# Altium project PCB_Project.PrjPcb
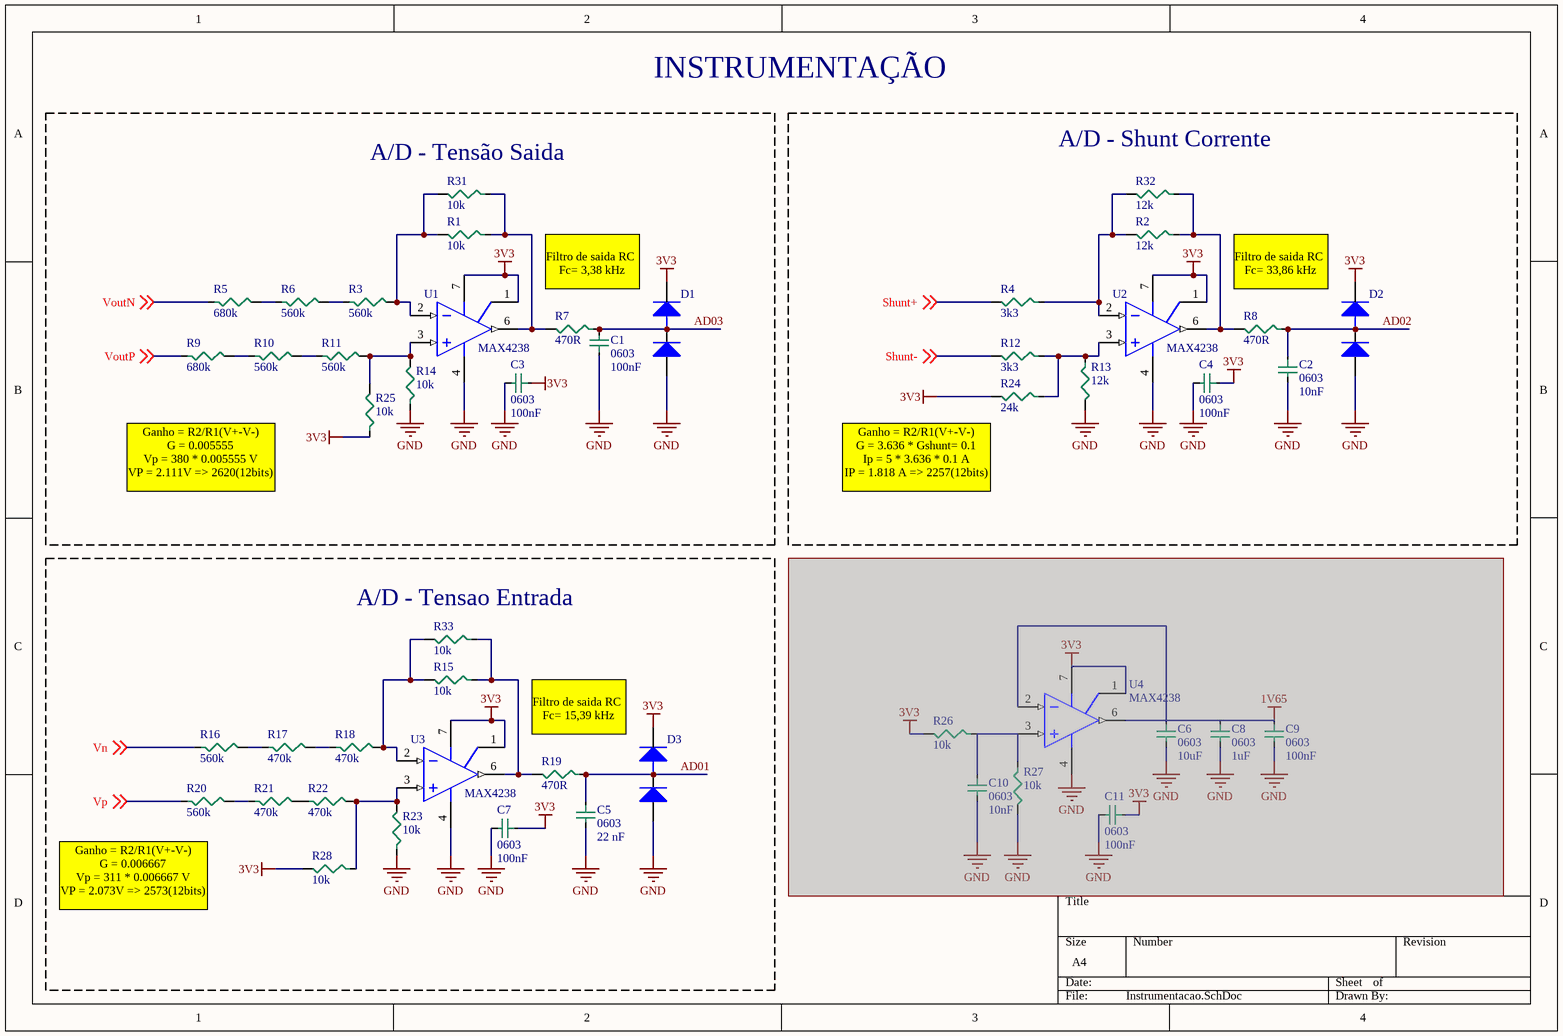
[diagram p0: Instrumentacao.SchDoc]
2 sheets, 95 parts. Net scope: global (net labels, ports and power ports of the same name join across sheets).
Board file: PCBv2.PcbDoc
Sheets:
  Instrumentacao.SchDoc
  GateDrive.SchDoc

## Sheet Instrumentacao.SchDoc
size A4

### Parts
(Parts that share a designator on the sheet are numbered #1, #2 ... from top to bottom, then left to right.)
C1  0603  value 100nF  [0603C]
C2  0603  value 10nF  [0603C]
C3  0603  value 100nF  [0603C]
C4  0603  value 100nF  [0603C]
C5  0603  value 22 nF  [0603C]
C6  0603  value 10uF  [0603C]  (masked out: inside a compile mask, not in the netlist)
C7  0603  value 100nF  [0603C]
C8#1  0603  value 1uF  [0603C]  (masked out: inside a compile mask, not in the netlist)
C9#1  0603  value 100nF  [0603C]  (masked out: inside a compile mask, not in the netlist)
C10#1  0603  value 10nF  [0603C]  (masked out: inside a compile mask, not in the netlist)
C11#1  0603  value 100nF  [0603C]  (masked out: inside a compile mask, not in the netlist)
D1  BAT54S  [SOT23]  (value not drawn)
D2  BAT54S  [SOT23]  (value not drawn)
D3  BAT54S  [SOT23]  (value not drawn)
R1  value 10k  [0603]  (hidden comment: 0603)
R2  value 12k  [0603]  (hidden comment: 0603)
R3  value 560k  [0603]  (hidden comment: 0603)
R4  value 3k3  [0603]  (hidden comment: 0603)
R5  value 680k  [0603]  (hidden comment: 0603)
R6  value 560k  [0603]  (hidden comment: 0603)
R7  value 470R  [0603]  (hidden comment: 0603)
R8  value 470R  [0603]  (hidden comment: 0603)
R9  value 680k  [0603]  (hidden comment: 0603)
R10  value 560k  [0603]  (hidden comment: 0603)
R11  value 560k  [0603]  (hidden comment: 0603)
R12  value 3k3  [0603]  (hidden comment: 0603)
R13  value 12k  [0603]  (hidden comment: 0603)
R14  value 10k  [0603]  (hidden comment: 0603)
R15  value 10k  [0603]  (hidden comment: 0603)
R16  value 560k  [0603]  (hidden comment: 0603)
R17  value 470k  [0603]  (hidden comment: 0603)
R18  value 470k  [0603]  (hidden comment: 0603)
R19  value 470R  [0603]  (hidden comment: 0603)
R20  value 560k  [0603]  (hidden comment: 0603)
R21  value 470k  [0603]  (hidden comment: 0603)
R22  value 470k  [0603]  (hidden comment: 0603)
R23  value 10k  [0603]  (hidden comment: 0603)
R24#1  value 24k  [0603]  (hidden comment: 0603)
R25#1  value 10k  [0603]  (hidden comment: 0603)
R26#1  value 10k  [0603]  (hidden comment: 0603)  (masked out: inside a compile mask, not in the netlist)
R27#1  value 10k  [0603]  (hidden comment: 0603)  (masked out: inside a compile mask, not in the netlist)
R28#1  value 10k  [0603]  (hidden comment: 0603)
R31#1  value 10k  [0603]  (hidden comment: 0603)
R32#1  value 12k  [0603]  (hidden comment: 0603)
R33#1  value 10k  [0603]  (hidden comment: 0603)
U1  MAX4238  [SOIC8]
U2  MAX4238  [SOIC8]
U3  MAX4238  [SOIC8]
U4#1  MAX4238  [SOIC8]  (masked out: inside a compile mask, not in the netlist)

### Blocks framed on the sheet
A/D - Tensão Saida: C1 C3 D1 R1 R3 R5-R7 R9-R11 R14 R25#1 R31#1 U1
A/D - Shunt Corrente: C2 C4 D2 R2 R4 R8 R12 R13 R24#1 R32#1 U2
A/D - Tensao Entrada: C5 C7 D3 R15-R23 R28#1 R33#1 U3

### Nets
3V3: C3.1 C4.1 C7.1 D1.2(K) D2.2(K) D3.2(K) R24#1.2 R25#1.1 R28#1.2 U1.1(BAL) U1.7(V+) U2.1(BAL) U2.7(V+) U3.1(BAL) U3.7(V+)
GND: C1.1 C2.2 C3.2 C4.2 C5.2 C7.2 D1.1(A) D2.1(A) D3.1(A) R13.2 R14.1 R23.1 U1.4(V-) U2.4(V-) U3.4(V-)
AD01: C5.1 D3.3(M) R19.1
AD02: C2.1 D2.3(M) R8.1
AD03: C1.2 D1.3(M) R7.1
Shunt+: R4.2 ; off-sheet Shunt+
Shunt-: R12.2 ; off-sheet Shunt-
Vn: R16.1 ; off-sheet Vn
VoutN: R5.1 ; off-sheet VoutN
VoutP: R9.1 ; off-sheet VoutP
Vp: R20.1 ; off-sheet Vp
NetR1_1: R1.1 R7.2 R31#1.1 U1.6(OUT)
NetR1_2: R1.2 R3.2 R31#1.2 U1.2(IN-)
NetR2_1: R2.1 R8.2 R32#1.1 U2.6(OUT)
NetR2_2: R2.2 R4.1 R32#1.2 U2.2(IN-)
NetR3_1: R3.1 R6.2
NetR5_2: R5.2 R6.1
NetR9_2: R9.2 R10.1
NetR10_2: R10.2 R11.1
NetR11_2: R11.2 R14.2 R25#1.2 U1.3(IN+)
NetR12_1: R12.1 R13.1 R24#1.1 U2.3(IN+)
NetR15_1: R15.1 R19.2 R33#1.1 U3.6(OUT)
NetR15_2: R15.2 R18.2 R33#1.2 U3.2(IN-)
NetR16_2: R16.2 R17.1
NetR17_2: R17.2 R18.1
NetR20_2: R20.2 R21.1
NetR21_2: R21.2 R22.1
NetR22_2: R22.2 R23.2 R28#1.1 U3.3(IN+)

### Notes on the sheet
- INSTRUMENTAÇÃO
- Filtro de saida RC
  Fc= 3,38 kHz
- Filtro de saida RC
  Fc= 33,86 kHz
- Ganho = R2/R1(V+-V-)
  G = 0.005555
  Vp = 380 * 0.005555 V
  VP = 2.111V => 2620(12bits)
- (near R24#1) Ganho = R2/R1(V+-V-)
  G = 3.636 * Gshunt= 0.1
  Ip = 5 * 3.636 * 0.1 A
  IP = 1.818 A => 2257(12bits)
- Filtro de saida RC
  Fc= 15,39 kHz
- (near R20) Ganho = R2/R1(V+-V-)
  G = 0.006667
  Vp = 311 * 0.006667 V
  VP = 2.073V => 2573(12bits)

### Library data of the parts
C1-C7 C8#1 C9#1 C10#1 C11#1 = Capacitor SMD 0603
D1-D3 = BAT54SFSCT-ND: DIODE SCHOTTKY 20V 0.5A SOD123; Supplier 1: Digi-Key; Supplier Part Number 1: BAT54SFSCT-ND
R1-R23 R24#1 R25#1 R26#1 R27#1 R28#1 R31#1 R32#1 R33#1 = Resistor SMD 0603 1/10 W: %: ±1%; P: 1/8W
U1-U3 U4#1 = MAX4238: IC OPAMP GP 1MHZ RRO 8SOIC; Supplier 1: Digi-Key; Supplier Part Number 1: MAX4238ASA+-ND

## Sheet GateDrive.SchDoc
size A4
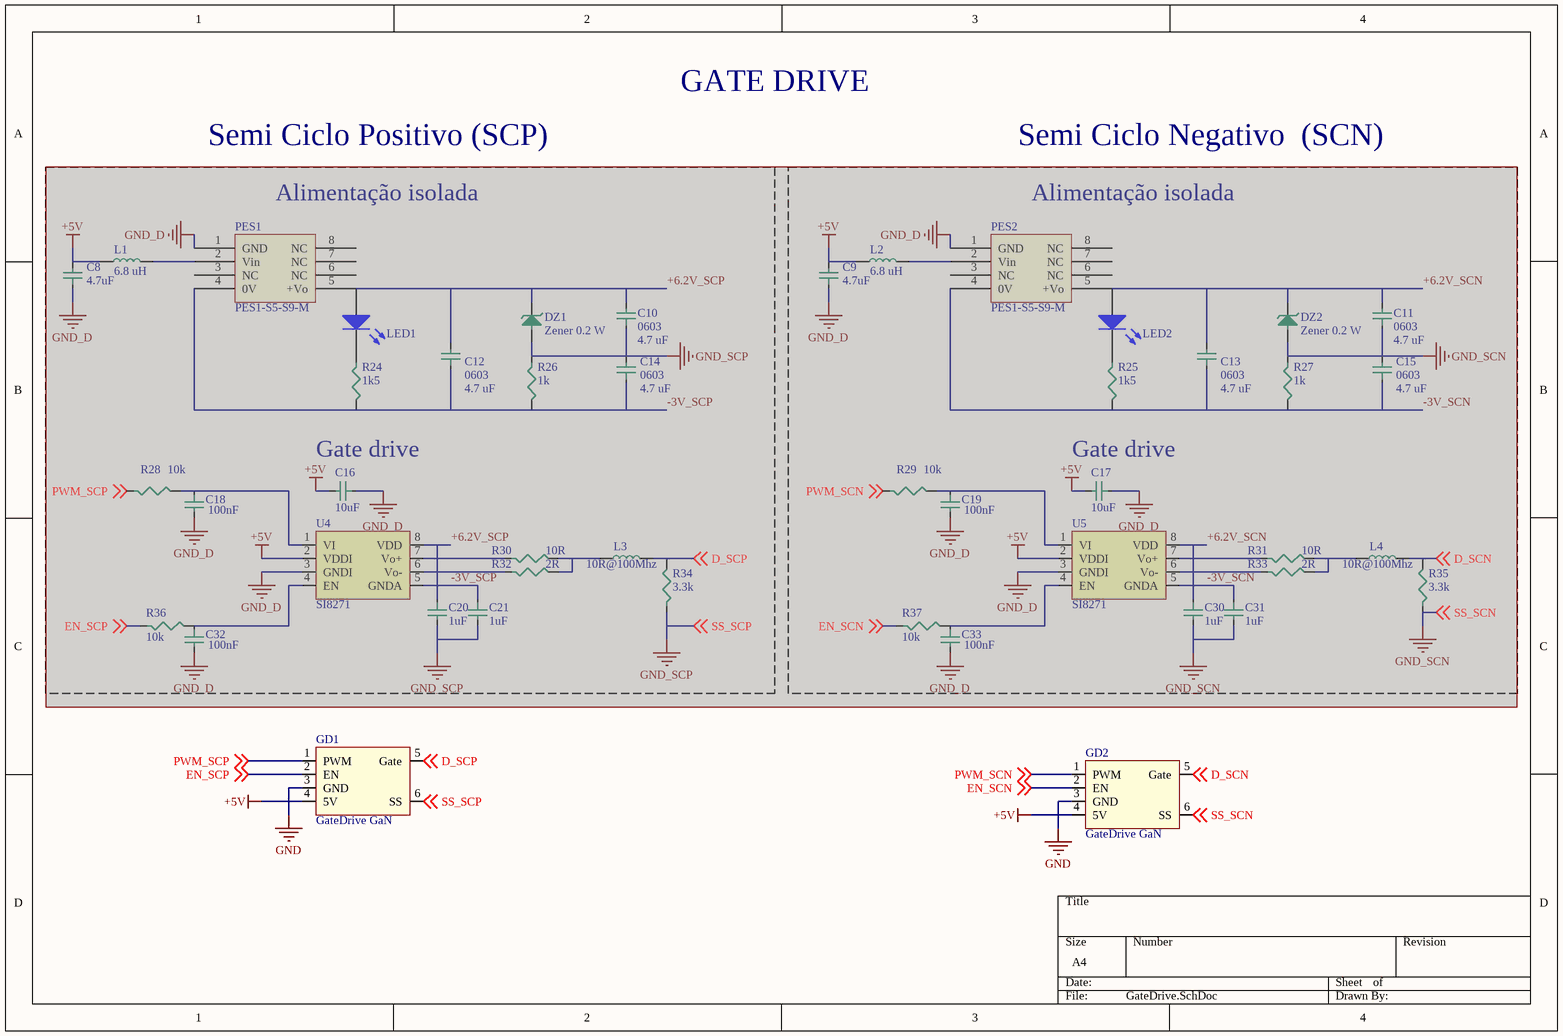
[diagram p1: GateDrive.SchDoc]

### Parts
(Parts that share a designator on the sheet are numbered #1, #2 ... from top to bottom, then left to right.)
C8#2  value 4.7uF  [0603C]  (hidden comment: 0603)  (masked out: inside a compile mask, not in the netlist)
C9#2  value 4.7uF  [0603C]  (hidden comment: 0603)  (masked out: inside a compile mask, not in the netlist)
C10#2  0603  value 4.7 uF  [0603C]  (masked out: inside a compile mask, not in the netlist)
C11#2  0603  value 4.7 uF  [0603C]  (masked out: inside a compile mask, not in the netlist)
C12  0603  value 4.7 uF  [0603C]  (masked out: inside a compile mask, not in the netlist)
C13  0603  value 4.7 uF  [0603C]  (masked out: inside a compile mask, not in the netlist)
C14  0603  value 4.7 uF  [0603C]  (masked out: inside a compile mask, not in the netlist)
C15  0603  value 4.7 uF  [0603C]  (masked out: inside a compile mask, not in the netlist)
C16  value 10uF  [0603C]  (hidden comment: 0603)  (masked out: inside a compile mask, not in the netlist)
C17  value 10uF  [0603C]  (hidden comment: 0603)  (masked out: inside a compile mask, not in the netlist)
C18  value 100nF  [0603C]  (hidden comment: 0603)  (masked out: inside a compile mask, not in the netlist)
C19  value 100nF  [0603C]  (hidden comment: 0603)  (masked out: inside a compile mask, not in the netlist)
C20  value 1uF  [0603C]  (hidden comment: 0603)  (masked out: inside a compile mask, not in the netlist)
C21  value 1uF  [0603C]  (hidden comment: 0603)  (masked out: inside a compile mask, not in the netlist)
C30  value 1uF  [0603C]  (hidden comment: 0603)  (masked out: inside a compile mask, not in the netlist)
C31  value 1uF  [0603C]  (hidden comment: 0603)  (masked out: inside a compile mask, not in the netlist)
C32  value 100nF  [0603C]  (hidden comment: 0603)  (masked out: inside a compile mask, not in the netlist)
C33  value 100nF  [0603C]  (hidden comment: 0603)  (masked out: inside a compile mask, not in the netlist)
DZ1  Zener 0.2 W  [SODF323]  (masked out: inside a compile mask, not in the netlist)
DZ2  Zener 0.2 W  [SODF323]  (masked out: inside a compile mask, not in the netlist)
GD1  GateDrive GaN  [GateDriveGaN]
GD2  GateDrive GaN  [GateDriveGaN]
L1  value 6.8 uH  [0805]  (hidden comment: 0805)  (masked out: inside a compile mask, not in the netlist)
L2  value 6.8 uH  [0805]  (hidden comment: 0805)  (masked out: inside a compile mask, not in the netlist)
L3  value 10R@100Mhz  [0603]  (hidden comment: 0603)  (masked out: inside a compile mask, not in the netlist)
L4  value 10R@100Mhz  [0603]  (hidden comment: 0603)  (masked out: inside a compile mask, not in the netlist)
LED1  LED 0603  [LED SMD 0603]  (value not drawn)  (masked out: inside a compile mask, not in the netlist)
LED2  LED 0603  [LED SMD 0603]  (value not drawn)  (masked out: inside a compile mask, not in the netlist)
PES1  PES1-S5-S9-M  [PES1]  (masked out: inside a compile mask, not in the netlist)
PES2  PES1-S5-S9-M  [PES1]  (masked out: inside a compile mask, not in the netlist)
R24#2  value 1k5  [0603]  (hidden comment: 0603)  (masked out: inside a compile mask, not in the netlist)
R25#2  value 1k5  [0603]  (hidden comment: 0603)  (masked out: inside a compile mask, not in the netlist)
R26#2  value 1k  [0603]  (hidden comment: 0603)  (masked out: inside a compile mask, not in the netlist)
R27#2  value 1k  [0603]  (hidden comment: 0603)  (masked out: inside a compile mask, not in the netlist)
R28#2  value 10k  [0603]  (hidden comment: 0603)  (masked out: inside a compile mask, not in the netlist)
R29  value 10k  [0603]  (hidden comment: 0603)  (masked out: inside a compile mask, not in the netlist)
R30  value 10R  [0603]  (hidden comment: 0603)  (masked out: inside a compile mask, not in the netlist)
R31#2  value 10R  [0603]  (hidden comment: 0603)  (masked out: inside a compile mask, not in the netlist)
R32#2  value 2R  [0603]  (hidden comment: 0603)  (masked out: inside a compile mask, not in the netlist)
R33#2  value 2R  [0603]  (hidden comment: 0603)  (masked out: inside a compile mask, not in the netlist)
R34  value 3.3k  [0603]  (hidden comment: 0603)  (masked out: inside a compile mask, not in the netlist)
R35  value 3.3k  [0603]  (hidden comment: 0603)  (masked out: inside a compile mask, not in the netlist)
R36  value 10k  [0603]  (hidden comment: 0603)  (masked out: inside a compile mask, not in the netlist)
R37  value 10k  [0603]  (hidden comment: 0603)  (masked out: inside a compile mask, not in the netlist)
U4#2  SI8271  [SOIC 8]  (masked out: inside a compile mask, not in the netlist)
U5  SI8271  [SOIC 8]  (masked out: inside a compile mask, not in the netlist)

### Blocks framed on the sheet
Semi Ciclo Positivo (SCP): C8#2 C10#2 C12 C14 C16 C18 C20 C21 C32 DZ1 L1 L3 LED1 PES1 R24#2 R26#2 R28#2 R30 R32#2 R34 R36 U4#2
Semi Ciclo Negativo  (SCN): C9#2 C11#2 C13 C15 C17 C19 C30 C31 C33 DZ2 L2 L4 LED2 PES2 R25#2 R27#2 R29 R31#2 R33#2 R35 R37 U5

### Nets
+5V: GD1.4(5V) GD2.4(5V)
GND: GD1.3(GND) GD2.3(GND)
D_SCN: GD2.5(Gate) ; off-sheet D_SCN
D_SCP: GD1.5(Gate) ; off-sheet D_SCP
EN_SCN: GD2.2(EN) ; off-sheet EN_SCN
EN_SCP: GD1.2(EN) ; off-sheet EN_SCP
PWM_SCN: GD2.1(PWM) ; off-sheet PWM_SCN
PWM_SCP: GD1.1(PWM) ; off-sheet PWM_SCP
SS_SCN: GD2.6(SS) ; off-sheet SS_SCN
SS_SCP: GD1.6(SS) ; off-sheet SS_SCP

### Notes on the sheet
- GATE DRIVE
- (near PES1) Alimentação isolada
- (near PES2) Alimentação isolada
- Gate drive

### Library data of the parts
C8#2 C9#2 C10#2 C11#2 C12-C21 C30-C33 = Capacitor SMD 0603
DZ1 DZ2 = Diodo Zener SOD-323: Zener Diodes ZEN REG 0.2W TR; ComponentLink1Description: Mouser; ComponentLink1URL: https://br.mouser.com/ProductDetail/ON-Semiconductor/SZMM3Z6V2ST1G?qs=%2Fha2pyFaduiqvyw2VWJ9YUoQUF9gtv6XafaMdWM45y6JO%2FkY2hYK5g%3D%3D
L1 L2 = Indutor SMD 0805
L3 L4 = Indutor SMD 0603
LED1 LED2 = LED 0603 SMD: Typical INFRARED GaAs LED; Published: 8-Jun-2000; LatestRevisionDate: 08-Jul-2005; LatestRevisionNote: Mech Layer 1 removed.; PackageReference: LED-0; Publisher: Altium Limited
PES1 PES2 = PES1-M: Isolated DC/DC Converters 1W 5Vin 9Vout SMT 12-111mA Iso UnReg; ComponentLink1Description: Datasheet; ComponentLink1URL: https://www.cui.com/product/resource/pes1-m.pdf; ComponentLink2Description: PES1-S5-S9-M; ComponentLink2URL: https://br.mouser.com/ProductDetail/CUI-Inc/PES1-S5-S9-M?qs=0OihrS3zgNXlv1CEgF62oQ%3D%3D
R24#2 R25#2 R26#2 R27#2 R28#2 R29 R30 R31#2 R32#2 R33#2 R34-R37 = Resistor SMD 0603 1/10 W: %: ±1%; P: 1/8W
U4#2 U5 = CI Driver GaN SI8271: Gate Drivers Hi CMTI 2.5 kV 3 V UVLO single isolated driver with deglitch; ComponentLink1Description: Mouser; ComponentLink1URL: https://br.mouser.com/ProductDetail/Silicon-Labs/SI8271GBD-IS?qs=r5DSvlrkXmIJOOORsVzmcg%3D%3D

## Nets that join several sheets
GND: Instrumentacao (15 pins), GateDrive (GD1.3 GD2.3)